# Altium project MyArduino.PrjPcb
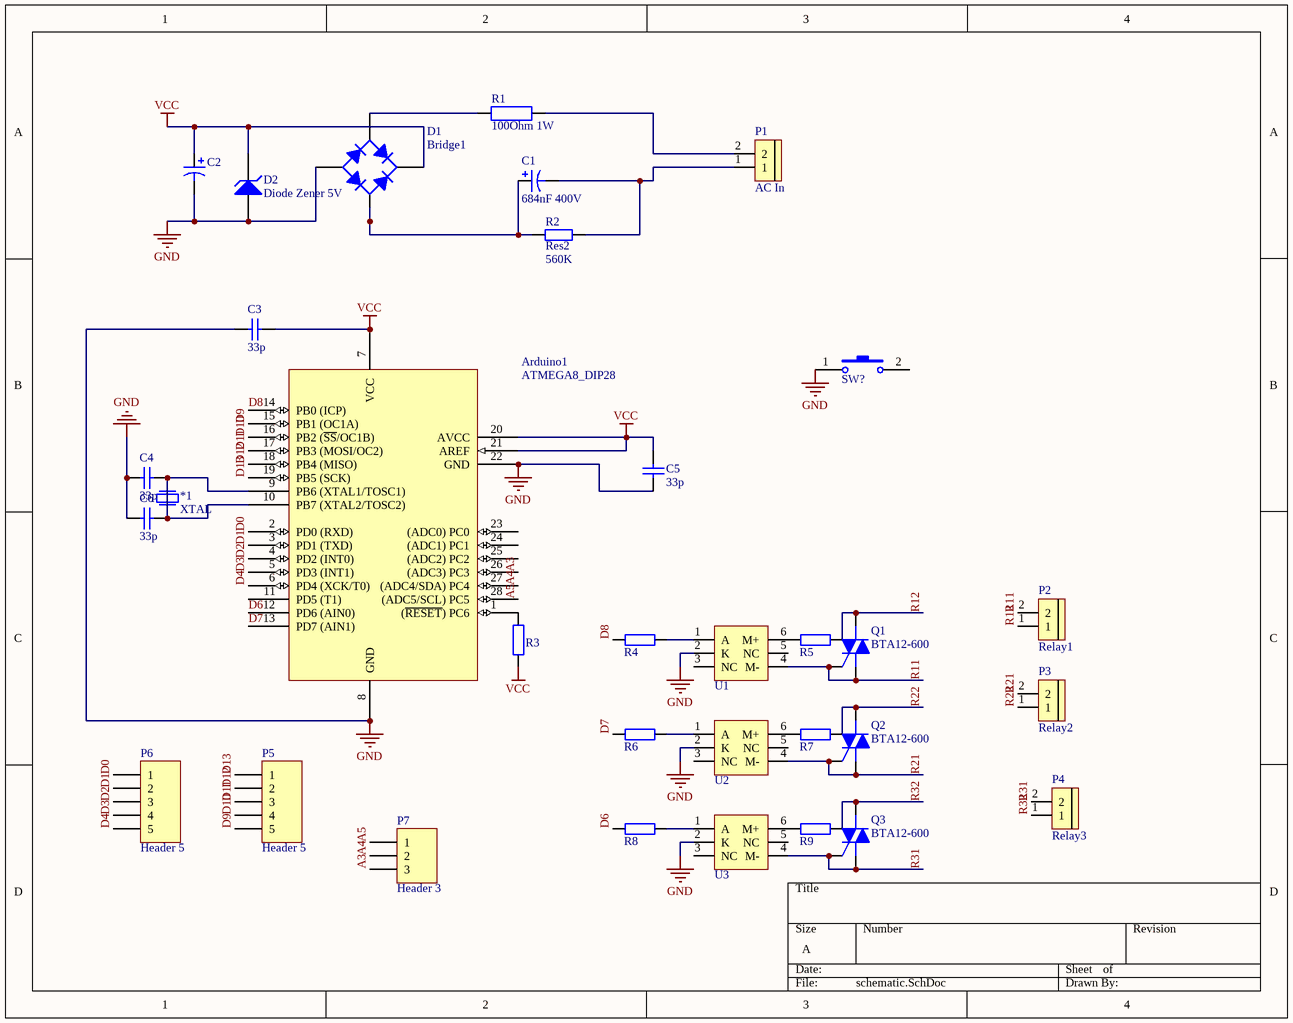
[diagram p0: schematic.SchDoc]
1 sheet, 33 parts. Net scope: global (net labels, ports and power ports of the same name join across sheets).
Board files: Main3.PcbDoc, Main.PcbDoc, Main2.PcbDoc

## Sheet schematic.SchDoc
size A

### Parts
*1  XTAL  [XTAL]
Arduino1  ATMEGA8_DIP28  [DIP-28]
C1  684nF 400V  [C10mm]
C2  1000uF  [C10mm]  (value not drawn)
C3  value 33p  [Tu-pico]  (hidden comment: Capacitor Ceramic)
C4  value 33p  [Tu-pico]  (hidden comment: Capacitor Ceramic)
C5  value 33p  [Tu-pico]  (hidden comment: Capacitor Ceramic)
C6  value 33p  [Tu-pico]  (hidden comment: Capacitor Ceramic)
D1  Bridge1  [D-38]
D2  Diode Zener 5V  [DIODE/NOM/0.5A]
P1  AC In  [BIG_Header 2]
P2  Relay1  [BIG_Header 2]
P3  Relay2  [BIG_Header 2]
P4  Relay3  [BIG_Header 2]
P5  Header 5  [HDR1X5]
P6  Header 5  [HDR1X5]
P7  Header 3  [HDR1X3]
Q1  BTA12-600  [BTA6-600]
Q2  BTA12-600  [BTA6-600]
Q3  BTA12-600  [BTA6-600]
R1  100Ohm 1W  [DIEN TRO 1W (tube)]
R2  Res2  value 560K  [AXIAL-0.4]
R3  1K  [R1/4W]  (value not drawn)
R4  1K  [R1/4W]  (value not drawn)
R5  470  [R1/4W]  (value not drawn)
R6  1K  [R1/4W]  (value not drawn)
R7  470  [R1/4W]  (value not drawn)
R8  1K  [R1/4W]  (value not drawn)
R9  470  [R1/4W]  (value not drawn)
SW?  SW-2P-S  [SW-2P-S]  (value not drawn)
U1  MOC3021M  [MOC30XX]  (value not drawn)
U2  MOC3021M  [MOC30XX]  (value not drawn)
U3  MOC3021M  [MOC30XX]  (value not drawn)

### Nets
GND: Arduino1.8(GND) Arduino1.22(GND) C2.2 C3.1 C4.2 C5.1 C6.2 D1.3(A) D2.1(A) SW?.1 U1.2(K) U2.2(K) U3.2(K)
VCC: Arduino1.7(VCC) Arduino1.20(AVCC) Arduino1.21(AREF) C2.1 C3.2 C5.2 D1.1(K) D2.2(K) R3.1
A3: Arduino1.26((ADC3)_PC3) P7.3
A4: Arduino1.27((ADC4/SDA)_PC4) P7.2
A5: Arduino1.28((ADC5/SCL)_PC5) P7.1
D0: Arduino1.2(PD0_(RXD)) P6.1
D1: Arduino1.3(PD1_(TXD)) P6.2
D2: Arduino1.4(PD2_(INT0)) P6.3
D3: Arduino1.5(PD3_(INT1)) P6.4
D4: Arduino1.6(PD4_(XCK/T0)) P6.5
D6: Arduino1.12(PD6_(AIN0)) R8.1
D7: Arduino1.13(PD7_(AIN1)) R6.1
D8: Arduino1.14(PB0_(ICP)) R4.1
D9: Arduino1.15(PB1_(OC1A)) P5.5
D10: Arduino1.16(PB2_(~{SS}/OC1B)) P5.4
D11: Arduino1.17(PB3_(MOSI/OC2)) P5.3
D12: Arduino1.18(PB4_(MISO)) P5.2
D13: Arduino1.19(PB5_(SCK)) P5.1
R11: P2.2 Q1.1(M1) Q1.3(G) U1.4(M-)
R12: P2.1 Q1.2(M2) R5.2
R21: P3.2 Q2.1(M1) Q2.3(G) U2.4(M-)
R22: P3.1 Q2.2(M2) R7.2
R31: P4.2 Q3.1(M1) Q3.3(G) U3.4(M-)
R32: P4.1 Q3.2(M2) R9.2
Net*1_1: *1.1(P1) *1.2(P2) Arduino1.9(PB6_(XTAL1/TOSC1)) Arduino1.10(PB7_(XTAL2/TOSC2)) C4.1 C6.1
NetArduino1_1: Arduino1.1((~{RESET})_PC6) R3.2
NetC1_1: C1.1 D1.2(C) R2.1
NetC1_2: C1.2 P1.1 R2.2
NetD1_4: D1.4(C) R1.1
NetP1_2: P1.2 R1.2
NetR4_2: R4.2 U1.1(A)
NetR5_1: R5.1 U1.6(M+)
NetR6_2: R6.2 U2.1(A)
NetR7_1: R7.1 U2.6(M+)
NetR8_2: R8.2 U3.1(A)
NetR9_1: R9.1 U3.6(M+)

Not connected (* = marked no-connect by the designer): Arduino1 11(PD5_(T1)) 23((ADC0)_PC0) 24((ADC1)_PC1) 25((ADC2)_PC2); SW? 2; U1 3(NC) 5(NC); U2 3(NC) 5(NC); U3 3(NC) 5(NC)

### Library data of the parts
Arduino1 = ATMEGA8_DIP28: Atmel Microcontroller - Library created by carel..  <www.mpfreezone.com>
C1 = Cap Pol 12mm: Polarized Capacitor (Axial); Published: 8-Jun-2000; LatestRevisionDate: 17-Jul-2002; LatestRevisionNote: Re-released for DXP Platform.; PackageReference: POLAR0.8; Publisher: Altium Limited
C2 = Cap Pol 8mm: Polarized Capacitor (Axial); Published: 8-Jun-2000; LatestRevisionDate: 17-Jul-2002; LatestRevisionNote: Re-released for DXP Platform.; PackageReference: POLAR0.8; Publisher: Altium Limited; Value: 1000uF
C3-C6 = CapCeramic: Capacitor; Published: 8-Jun-2000; LatestRevisionDate: 17-Jul-2002; LatestRevisionNote: Re-released for DXP Platform.; PackageReference: RAD-0.3; Publisher: Altium Limited
D1 = Bridge1: Full Wave Diode Bridge; Published: 8-Jun-2000; LatestRevisionDate: 29-May-2009; LatestRevisionNote: Sch pins A & K swapped.; DatasheetVersion: E2732B; PackageReference: D-38; Publisher: Altium Limited; PackageDescription: Bridge Rectifier; 4 Terminals; Body 9.4 x 9.4 mm (typ); Pitch 5.08 mm
D2 = Diode Zener: Zener Diode; Voltage: 5; Published: 8-Jun-2000; LatestRevisionDate: 17-Jul-2002; LatestRevisionNote: Re-released for DXP Platform.; PackageReference: DIODE-0.7; Publisher: Altium Limited
P1-P4 = BIG_Header 2
P5 P6 = Header 5: Header, 5-Pin; LatestRevisionDate: 17-Jul-2002; LatestRevisionNote: Re-released for DXP Platform.; Publisher: Altium Limited
P7 = Header 3: Header, 3-Pin; LatestRevisionDate: 17-Jul-2002; LatestRevisionNote: Re-released for DXP Platform.; Publisher: Altium Limited
Q1-Q3 = BTA12-600: Silicon Bidirectional Triode Thyristor; Note: Pin 2 is electrically connected to Pin 4 (TAB); Published: 29-Sep-2000; LatestRevisionDate: 17-Jul-2002; LatestRevisionNote: Re-released for DXP Platform.; DatasheetDocument: 1999; PackageReference: 369-03; Publisher: Altium Limited; Code_JEDEC: TO-251-AA; ComponentLink1Description: Manufacturer Link; ComponentLink1URL: http://www.motorola.com/
R1 = Res 1W: 1W Res Power; Value: 100; Voltage: 400; Creator: Nguyen Ba Bien
R2 = Res2: Resistor; Published: 8-Jun-2000; LatestRevisionDate: 17-Jul-2002; LatestRevisionNote: Re-released for DXP Platform.; PackageReference: AXIAL-0.4; Publisher: Altium Limited; PackageDescription: Axial Device, Thru-Hole; 2 Leads; 0.4 in Pin Spacing
R3 = R1/4W: Resistor; Value: 10K
R4 R6 R8 = R1/4W: Resistor; Value: 470
R5 R7 R9 = R1/4W: Resistor; Value: 470
SW? = SW-2PIN-SMALL: Switch Small 2 Pin; Published: 24-Mar-1999; LatestRevisionDate: 17-Jul-2002; LatestRevisionNote: Re-released for DXP Platform.; PackageReference: SPST-2; Publisher: Altium Limited